# EAGLE schematic Pi3_Analog_hat (EAGLE 7.6.0)

## Sheet 1 of 2
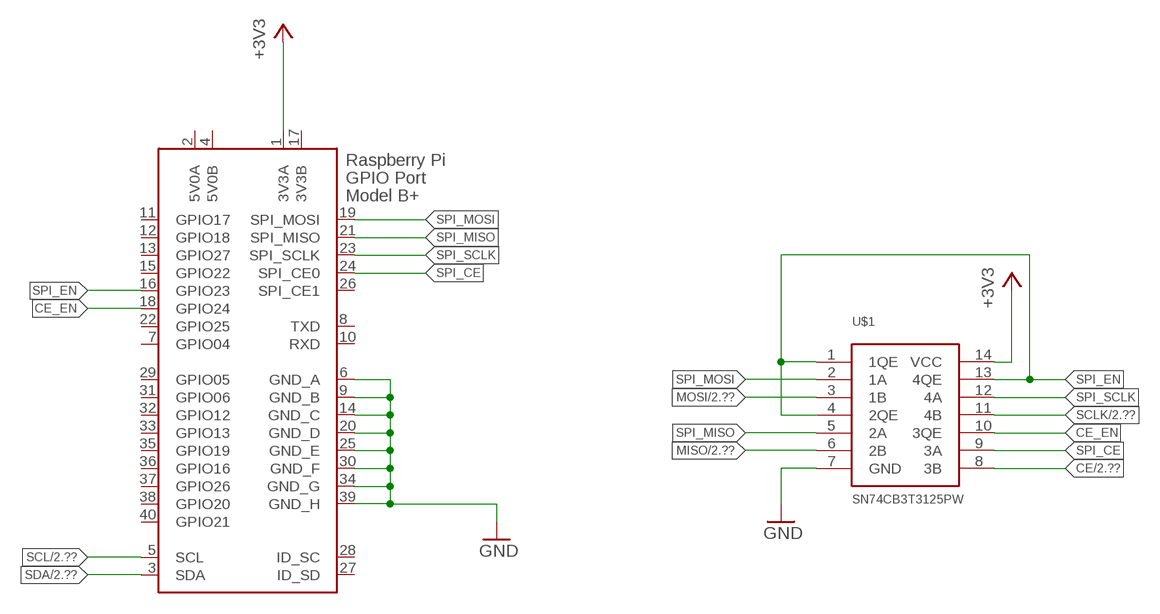
[diagram p0: schematic, sheet 1]

### Parts
U$1  SN74CB3T3125PW  [TSSOP-14]
X1  RASPI_BOARD_B+#_HD  [RASPI_BOARD_B+HAT_DF]

### Nets
+3V3: U$1.14(VCC) X1.1(3V3A) ; also sheet 2
CE: U$1.8(3B) ; also sheet 2
CE_EN: U$1.10(3QE) X1.18(GPIO24)
GND: U$1.7(GND) X1.6(GND_A) X1.9(GND_B) X1.14(GND_C) X1.20(GND_D) X1.25(GND_E) X1.30(GND_F) X1.34(GND_G) X1.39(GND_H) ; also sheet 2
MISO: U$1.6(2B) ; also sheet 2
MOSI: U$1.3(1B) ; also sheet 2
SCL: X1.5(SCL) ; also sheet 2
SCLK: U$1.11(4B) ; also sheet 2
SDA: X1.3(SDA) ; also sheet 2
SPI_CE: U$1.9(3A) X1.24(SPI_CE0)
SPI_EN: U$1.1(1QE) U$1.4(2QE) U$1.13(4QE) X1.16(GPIO23)
SPI_MISO: U$1.5(2A) X1.21(SPI_MISO)
SPI_MOSI: U$1.2(1A) X1.19(SPI_MOSI)
SPI_SCLK: U$1.12(4A) X1.23(SPI_SCLK)
Unconnected: X1.7(GPIO04) X1.8(TXD) X1.10(RXD) X1.11(GPIO17) X1.12(GPIO18) X1.13(GPIO27) X1.15(GPIO22) X1.22(GPIO25) X1.26(SPI_CE1) X1.27(ID_SD) X1.28(ID_SC) X1.29(GPIO05) X1.31(GPIO06) X1.32(GPIO12) X1.33(GPIO13) X1.35(GPIO19) X1.36(GPIO16) X1.37(GPIO26) X1.38(GPIO20) X1.40(GPIO21)

## Sheet 2 of 2
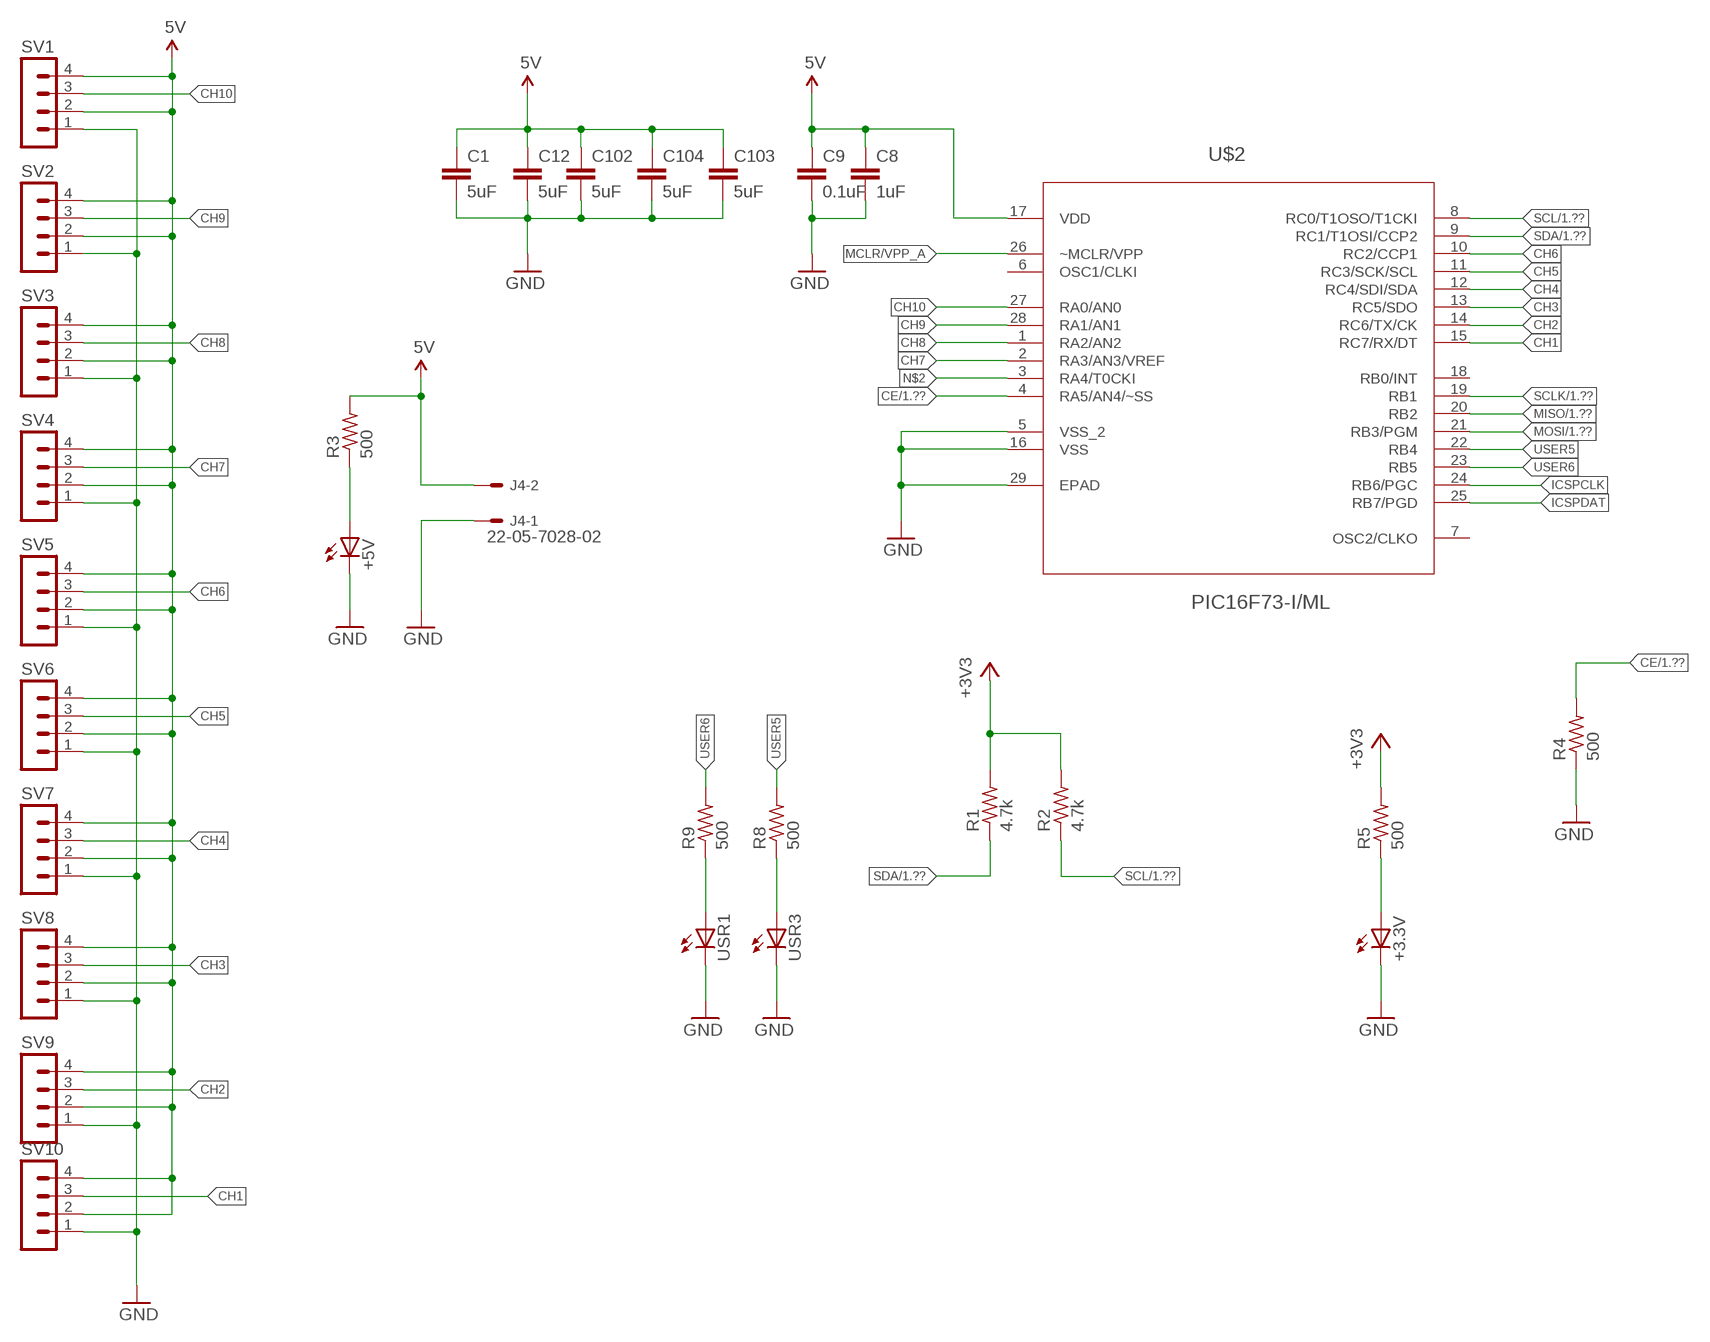
[diagram p1: schematic, sheet 2]

### Parts
+3.3V  LEDCHIP-LED0603  [CHIP-LED0603]
+5V  LEDCHIP-LED0603  [CHIP-LED0603]
C1  5uF  C-EUC0402  [C0402]
C8  1uF  C-EUC0402  [C0402]
C9  0.1uF  C-EUC0402  [C0402]
C12  5uF  C-EUC0402  [C0402]
C102  5uF  C-EUC0402  [C0402]
C103  5uF  C-EUC0402  [C0402]
C104  5uF  C-EUC0402  [C0402]
J4  22-05-7028-02  [7395-02]
R1  4.7k  R-US_R0402  [R0402]
R2  4.7k  R-US_R0402  [R0402]
R3  500  R-US_R0402  [R0402]
R4  500  R-US_R0402  [R0402]
R5  500  R-US_R0402  [R0402]
R8  500  R-US_R0402  [R0402]
R9  500  R-US_R0402  [R0402]
SV1  MA04-1  [MA04-1]
SV2  MA04-1  [MA04-1]
SV3  MA04-1  [MA04-1]
SV4  MA04-1  [MA04-1]
SV5  MA04-1  [MA04-1]
SV6  MA04-1  [MA04-1]
SV7  MA04-1  [MA04-1]
SV8  MA04-1  [MA04-1]
SV9  MA04-1  [MA04-1]
SV10  MA04-1  [MA04-1]
U$2  PIC16F73-I/ML  [QFN65P600X600X100-28N]
USR1  LEDCHIP-LED0603  [CHIP-LED0603]
USR3  LEDCHIP-LED0603  [CHIP-LED0603]

### Nets
5V: C1.1 C8.1 C9.1 C12.1 C102.1 C103.1 C104.1 J4.2 R3.2 SV1.2 SV1.4 SV2.2 SV2.4 SV3.2 SV3.4 SV4.2 SV4.4 SV5.2 SV5.4 SV6.2 SV6.4 SV7.2 SV7.4 SV8.2 SV8.4 SV9.2 SV9.4 SV10.2 SV10.4 U$2.17(VDD)
+3V3: R1.2 R2.2 R5.2 ; also sheet 1
CE: R4.2 U$2.4(RA5/AN4/~SS) ; also sheet 1
CH1: SV10.3 U$2.15(RC7/RX/DT)
CH2: SV9.3 U$2.14(RC6/TX/CK)
CH3: SV8.3 U$2.13(RC5/SDO)
CH4: SV7.3 U$2.12(RC4/SDI/SDA)
CH5: SV6.3 U$2.11(RC3/SCK/SCL)
CH6: SV5.3 U$2.10(RC2/CCP1)
CH7: SV4.3 U$2.2(RA3/AN3/VREF)
CH8: SV3.3 U$2.1(RA2/AN2)
CH9: SV2.3 U$2.28(RA1/AN1)
CH10: SV1.3 U$2.27(RA0/AN0)
GND: +3.3V.C +5V.C C1.2 C8.2 C9.2 C12.2 C102.2 C103.2 C104.2 J4.1 R4.1 SV1.1 SV2.1 SV3.1 SV4.1 SV5.1 SV6.1 SV7.1 SV8.1 SV9.1 SV10.1 U$2.5(VSS_2) U$2.16(VSS) U$2.29(EPAD) USR1.C USR3.C ; also sheet 1
ICSPCLK: U$2.24(RB6/PGC)
ICSPDAT: U$2.25(RB7/PGD)
MCLR/VPP_A: U$2.26(~MCLR/VPP)
MISO: U$2.20(RB2) ; also sheet 1
MOSI: U$2.21(RB3/PGM) ; also sheet 1
N$1: +5V.A R3.1
N$2: U$2.3(RA4/T0CKI)
N$3: +3.3V.A R5.1
N$9: R8.1 USR3.A
N$10: R9.1 USR1.A
SCL: R2.1 U$2.8(RC0/T1OSO/T1CKI) ; also sheet 1
SCLK: U$2.19(RB1) ; also sheet 1
SDA: R1.1 U$2.9(RC1/T1OSI/CCP2) ; also sheet 1
USER5: R8.2 U$2.22(RB4)
USER6: R9.2 U$2.23(RB5)
Unconnected: U$2.6(OSC1/CLKI) U$2.7(OSC2/CLKO) U$2.18(RB0/INT)

## Power pins joined to a net without a drawn wire
3V3B: X1.17(3V3B)
5V0A: X1.2(5V0A)
5V0B: X1.4(5V0B)

## Library data of the parts
+3.3V +5V USR1 USR3 = led:LED: LED OSRAM: - CHIPLED LG R971, LG N971, LY N971, LG Q971, LY Q971, LO R971, LY R971 LH N974, LH R974 LS Q976, LO Q976, LY Q976 LO Q996 - Hyper CHIPLED LW Q18S LB Q993, LB Q99A, LB R99A - SideLED LS A670, LO A670, LY A670, LG A670, LP A670 LB A673, LV A673, LT A673, LW A673 LH A674 LY A675 LS A676, LA A676, LO A676, LY A676, LW A676 LS A679, LY A679, LG A679 - Hyper Micro SIDELED® LS Y876, LA Y876, LO Y876, LY Y876 LT Y87S - SmartLED LW L88C, LW L88S LB L89C, LB L89S, LG L890 LS L89K, LO L89K, LY L89K LS L896, LA L896, LO L896, LY L896 - TOPLED LS T670, LO T670, LY T670, LG T670, LP T670 LSG T670, LSP T670, LSY T670, LOP T670, LYG T670 LG T671, LOG T671, LSG T671 LB T673, LV T673, LT T673, LW T673 LH T674 LS T676, LA T676, LO T676, LY T676, LB T676, LH T676, LSB T676, LW T676 LB T67C, LV T67C, LT T67C, LS T67K, LO T67K, LY T67K, LW E67C LS E67B, LA E67B, LO E67B, LY E67B, LB E67C, LV E67C, LT E67C LW T67C LS T679, LY T679, LG T679 LS T770, LO T770, LY T770, LG T770, LP T770 LB T773, LV T773, LT T773, LW T773 LH T774 LS E675, LA E675, LY E675, LS T675 LS T776, LA T776, LO T776, LY T776, LB T776 LHGB T686 LT T68C, LB T68C - Hyper Mini TOPLED® LB M676 - Mini TOPLED Santana® LG M470 LS M47K, LO M47K, LY M47K Source: http://www.osram.convergy.de LUXEON: - LUMILED® LXK2-PW12-R00, LXK2-PW12-S00, LXK2-PW14-U00, LXK2-PW14-V00 LXK2-PM12-R00, LXK2-PM12-S00, LXK2-PM14-U00 LXK2-PE12-Q00, LXK2-PE12-R00, LXK2-PE12-S00, LXK2-PE14-T00, LXK2-PE14-U00 LXK2-PB12-K00, LXK2-PB12-L00, LXK2-PB12-M00, LXK2-PB14-N00, LXK2-PB14-P00, LXK2-PB14-Q00 LXK2-PR12-L00, LXK2-PR12-M00, LXK2-PR14-Q00, LXK2-PR14-R00 LXK2-PD12-Q00, LXK2-PD12-R00, LXK2-PD12-S00 LXK2-PH12-R00, LXK2-PH12-S00 LXK2-PL12-P00, LXK2-PL12-Q00, LXK2-PL12-R00 Source: www.luxeon.com KINGBRIGHT: KA-3528ASYC Source: www.kingbright.com
C1 C8 C9 C12 C102-C104 = rcl:C-EU: CAPACITOR, European symbol
J4 = con-molex:22-?-02: CONNECTOR wire to board 2.54 mm (.1 inch) pitch header; OC_FARNELL: 9731601; OC_NEWARK: unknown
R1-R5 R8 R9 = resistor:R-US_: RESISTOR, American symbol
SV1-SV10 = con-lstb:MA04-1: PIN HEADER; OC_FARNELL: unknown; OC_NEWARK: unknown
U$1 = SN74CB3T3125PW:SN74CB3T3125PW
U$2 = Microchip_By_element14_Batch_1:PIC16F73-I/ML: 8-bit CMOS FLASH Microcontrollers; DESCRIPTION: 8-bit CMOS FLASH Microcontrollers; MPN: PIC16F73-I/ML; OC_FARNELL: 1084327; OC_NEWARK: 97K7368; PACKAGE: QFN-28; SUPPLIER: Microchip
X1 = Pi3_Power_hat_Rev1:RASPI_BOARD_B+#: Raspberry Pi GPIO connector with markings for the outer dimensions of the Raspberry Pi board model B+ with different sets of drill holes or mounting pads All pins connected